# Altium schematic sheet CurrentSensorLatch.SchDoc
size B; SheetNumber: 1; SheetTotal: 2
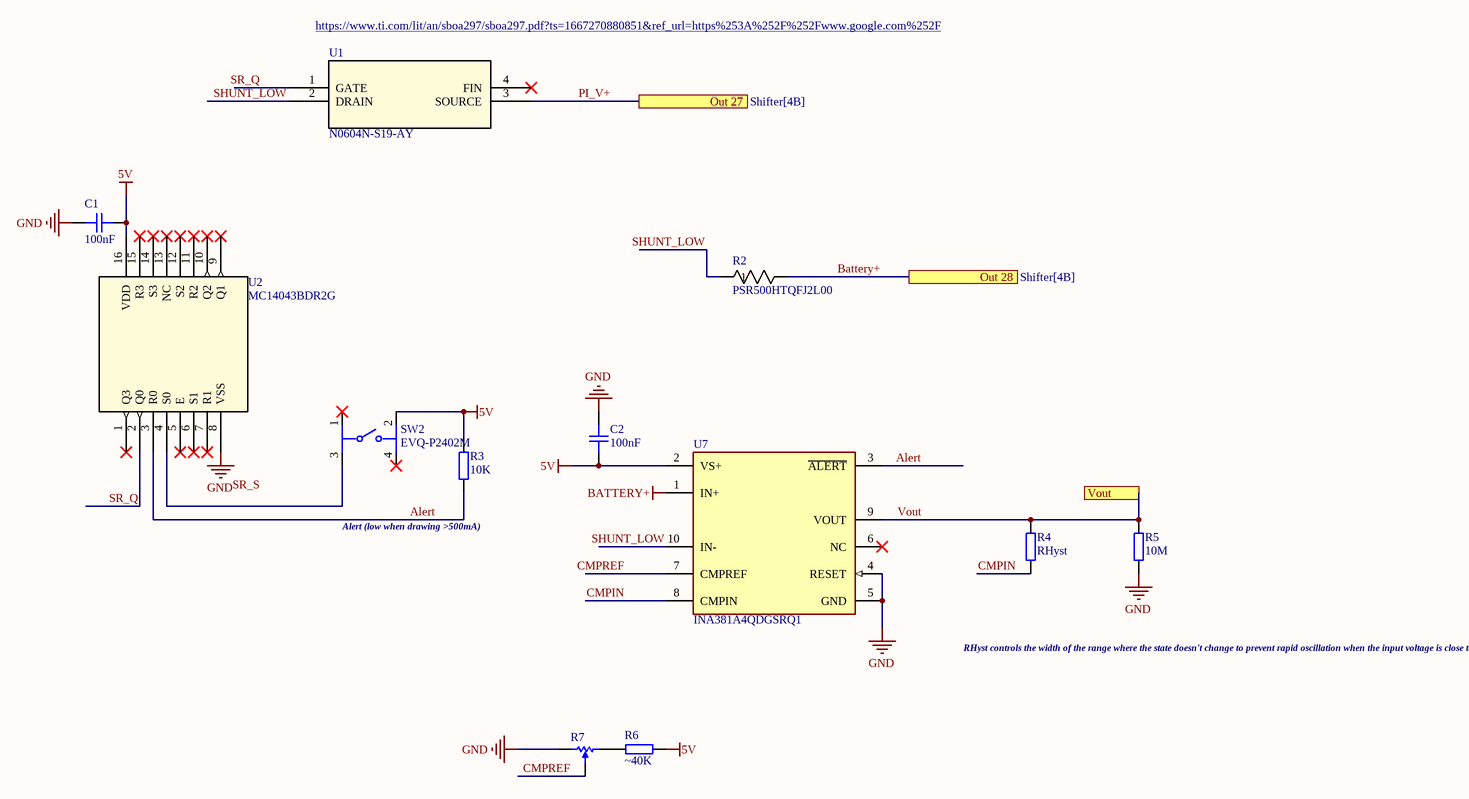
[diagram p0: CurrentSensorLatch.SchDoc]

## Parts
C1  100nF  [CAP_0805]
C2  100nF  [CAP_0805]
R2  PSR500HTQFJ2L00  [RES_PSR500_ROM]
R3  10K  [RES_0603]
R4  RHyst  [RES_0603]
R5  10M  [RES_0603]
R6  ~40K  [RES_0603]
R7  35WR10KLFTR  [BI-35WR10KLFTR-3_V]  (value not drawn)
SW2  EVQ-P2402M  [FP-EVQ-P2402M-MFG]
U1  N0604N-S19-AY  [TO-220_REN]
U2  MC14043BDR2G  [SOIC-16_ONS]
U7  INA381A4QDGSRQ1  [FP-DGS0010A-IPC_B]

## Ports
Out 27 (see Shifter[4B]), Out 28 (see Shifter[4B]), Vout

## Nets
5V: C1.2 C2.2 R3.2 R6.2 SW2.2 U2.16(VDD) U7.2(VS+)
Battery+: R2.2 U7.1(IN+) ; port Out 28
GND: C1.1 C2.1 R5.1 R7.1 U2.8(VSS) U7.4(RESET) U7.5(GND)
Alert: R3.1 U2.3(R0) U7.3(~{ALERT})
CMPIN: R4.1 U7.8(CMPIN)
CMPREF: R7.2 U7.7(CMPREF)
PI_V+: U1.3(SOURCE) ; port Out 27
SHUNT_LOW: R2.1 U1.2(DRAIN) U7.10(IN-)
SR_Q: U1.1(GATE) U2.2(Q0)
Vout: R4.2 R5.2 U7.9(VOUT) ; port Vout
NetR6_1: R6.1 R7.3
NetSW2_3: SW2.3 U2.4(S0)

Not connected (* = marked no-connect by the designer): SW2 1* 4*; U1 4(FIN)*; U2 1(Q3)* 5(E)* 6(S1)* 7(R1)* 9(Q1)* 10(Q2)* 11(R2)* 12(S2)* 13(NC)* 14(S3)* 15(R3)*; U7 6(NC)*

## Notes on the sheet
- https://www.ti.com/lit/an/sboa297/sboa297.pdf?ts=1667270880851&ref_url=https%253A%252F%252Fwww.google.com%252F
- (near R3) Alert (low when drawing >500mA)
- RHyst controls the width of the range where the state doesn't change to prevent rapid oscillation when the input voltage is close to the reference voltage
- Labels drawn without touching a wire or pin: SR_S

## Library data of the parts
C1 C2 = CAP_0805_16V: Capacitor SMD 0805 16V
R2 = PSR500HTQFJ2L00: No Description Available; Mfr_Name: ROHM Semiconductor
R3-R6 = RES_0603: Resistor SMD 0603; Manufacturer: *; Manufacturer Part Number: *; Distributor Link: *
R7 = CMP-009-00041-2: 3 mm Single-Turn Open Frame Surface Mount Cermet Trimming Potentiometer, +/- 25%, 35 W, -40 to 125 degC, 3-Pin SMD, RoHS, Tape and Reel; Manufacturer: BI Technologies; Resistance: 10k; Power: 100mW; Voltage Rating: 50V; Mounting Technology: SM; RoHS Compliant: True; Manufacturer URL: http://www.bi-technologies.net/; Package Quantity: 2000; Package Description: 3-Pin Surface Mount Device, Body 3 x 3.1 mm; Max Operating Temperature: 125°C; Composition: Potentiometer; Packaging: TapeandReel; Datasheet Version: Feb-10; Datasheet URL: http://www.bitechnologies.com/pdfs/35.pdf; Min Operating Temperature: -40°C; Package Reference: 35WR10KLFTR; Case/Package: 35WR10KLFTR; Tolerance: 25%
SW2 = CMP-05618-000087-1: SWITCH TACTILE SPST-NO 0.02A 15V; Mechanical Life: 500000Cycles; Contact Resistance: 100mR; Max Current Rating: 20mA; Throw Configuration: SPST; Switch Function: Off-Mom; Illumination Type: Non-Illuminated; Actuator Color: Natural; Operating Force: 2.4N; Actuator Length: 0.45mm; Switch Travel: 0.25mm; Color: Clear; Size: 3.5mm; Radiation Hardening: No; Mount: Surface Mount; Package Quantity: 1; Length: 3.5mm; Height: 2.1mm; Series: EVQP2; Contact Current Rating: 20mA; Termination: J-Bend; Electrical Life: 500000Cycles; Packaging: Tape and Reel; Current Rating: 20mA; Max Operating Temperature: 85°C; Orientation: Straight; Width: 3.5mm; Max Voltage Rating (DC): 15V; RoHS Compliant: Yes; REACH SVHC: No SVHC; Min Operating Temperature: -40°C; Depth: 5.5mm; Voltage Rating (DC): 15V; Lead Free: Lead Free
U1 = N0604N-S19-AY: No Description Available; Mfr_Name: Renesas Electronics; RefDes: RefDes; Type: Type
U2 = MC14043BDR2G: No Description Available; Mfr_Name: onsemi; RefDes: RefDes; Type: Type
U7 = CMP-04895-000492-1: CURRENT SENSE AMPLIFIER / INA381A4; Accuracy: 1%; Max Operating Temperature: 125°C; Min Operating Temperature: -40°C; Mount: Surface Mount; Series: Automotive, AEC-Q100; Case/Package: VSSOP